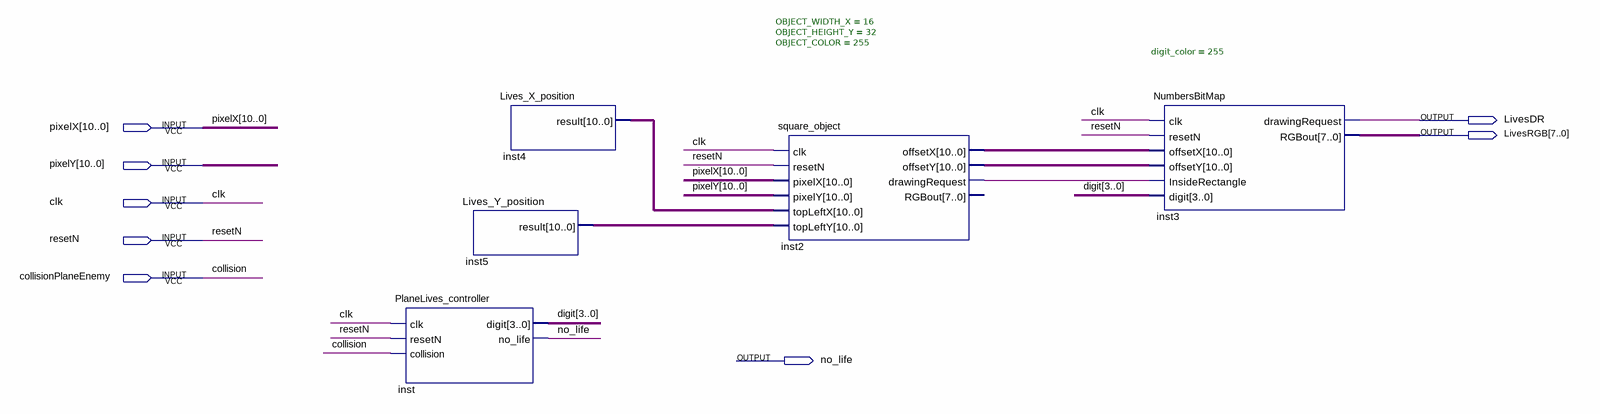
[diagram p0: schematic sheet]
// Quartus schematic PlaneLives_Block_T.bdf as structural Verilog: 5 symbols, 8 pins
module PlaneLives_Block_T (
  input  [10:0] pixelX,
  input  [10:0] pixelY,
  input  clk,
  input  resetN,
  input  collisionPlaneEnemy,
  output LivesDR,
  output [7:0] LivesRGB,
  output no_life
);

  wire inst2_drawingrequest;
  wire [3:0] digit;
  wire [10:0] inst2_offsetx, inst2_offsety, inst4_result, inst5_result;

  PlaneLives_controller inst (
    .clk(clk), .resetN(resetN), .collision(collisionPlaneEnemy), .digit(digit), .no_life(no_life));
  Lives_Y_position inst5 (.result(inst5_result));
  Lives_X_position inst4 (.result(inst4_result));
  square_object #(.OBJECT_WIDTH_X(16), .OBJECT_HEIGHT_Y(32), .OBJECT_COLOR(255)) inst2 (
    .clk(clk), .resetN(resetN), .pixelX(pixelX), .pixelY(pixelY), .topLeftX(inst4_result),
    .topLeftY(inst5_result), .offsetX(inst2_offsetx), .offsetY(inst2_offsety),
    .drawingRequest(inst2_drawingrequest));  // open: RGBout
  NumbersBitMap #(.digit_color(255)) inst3 (
    .clk(clk), .resetN(resetN), .offsetX(inst2_offsetx), .offsetY(inst2_offsety),
    .InsideRectangle(inst2_drawingrequest), .digit(digit), .drawingRequest(LivesDR), .RGBout(LivesRGB));

  // Other names for the same wires on the sheet: collision = collisionPlaneEnemy
endmodule
